# Altium schematic sheet dsPIC Click MCU v1.0.SchDoc
size B; SheetNumber: 1; SheetTotal: 2; PageSetup: Record=PageOptions|CenterHorizontal=True|CenterVertical=True|PrintScale=0.71|XCorrection=1.00|YCorrection=1.00|PrintKind=0|BorderSize=5000000|LeftOffset=0|BottomOffset=0|Orientation=2|PaperLength=1000|PaperWidth=1000|Scale=100|PaperSource=7|PrintQuality=-3|MediaType=1|DitherType=10|PrintScaleMode=1|PaperKind=Letter|PaperIndex=1
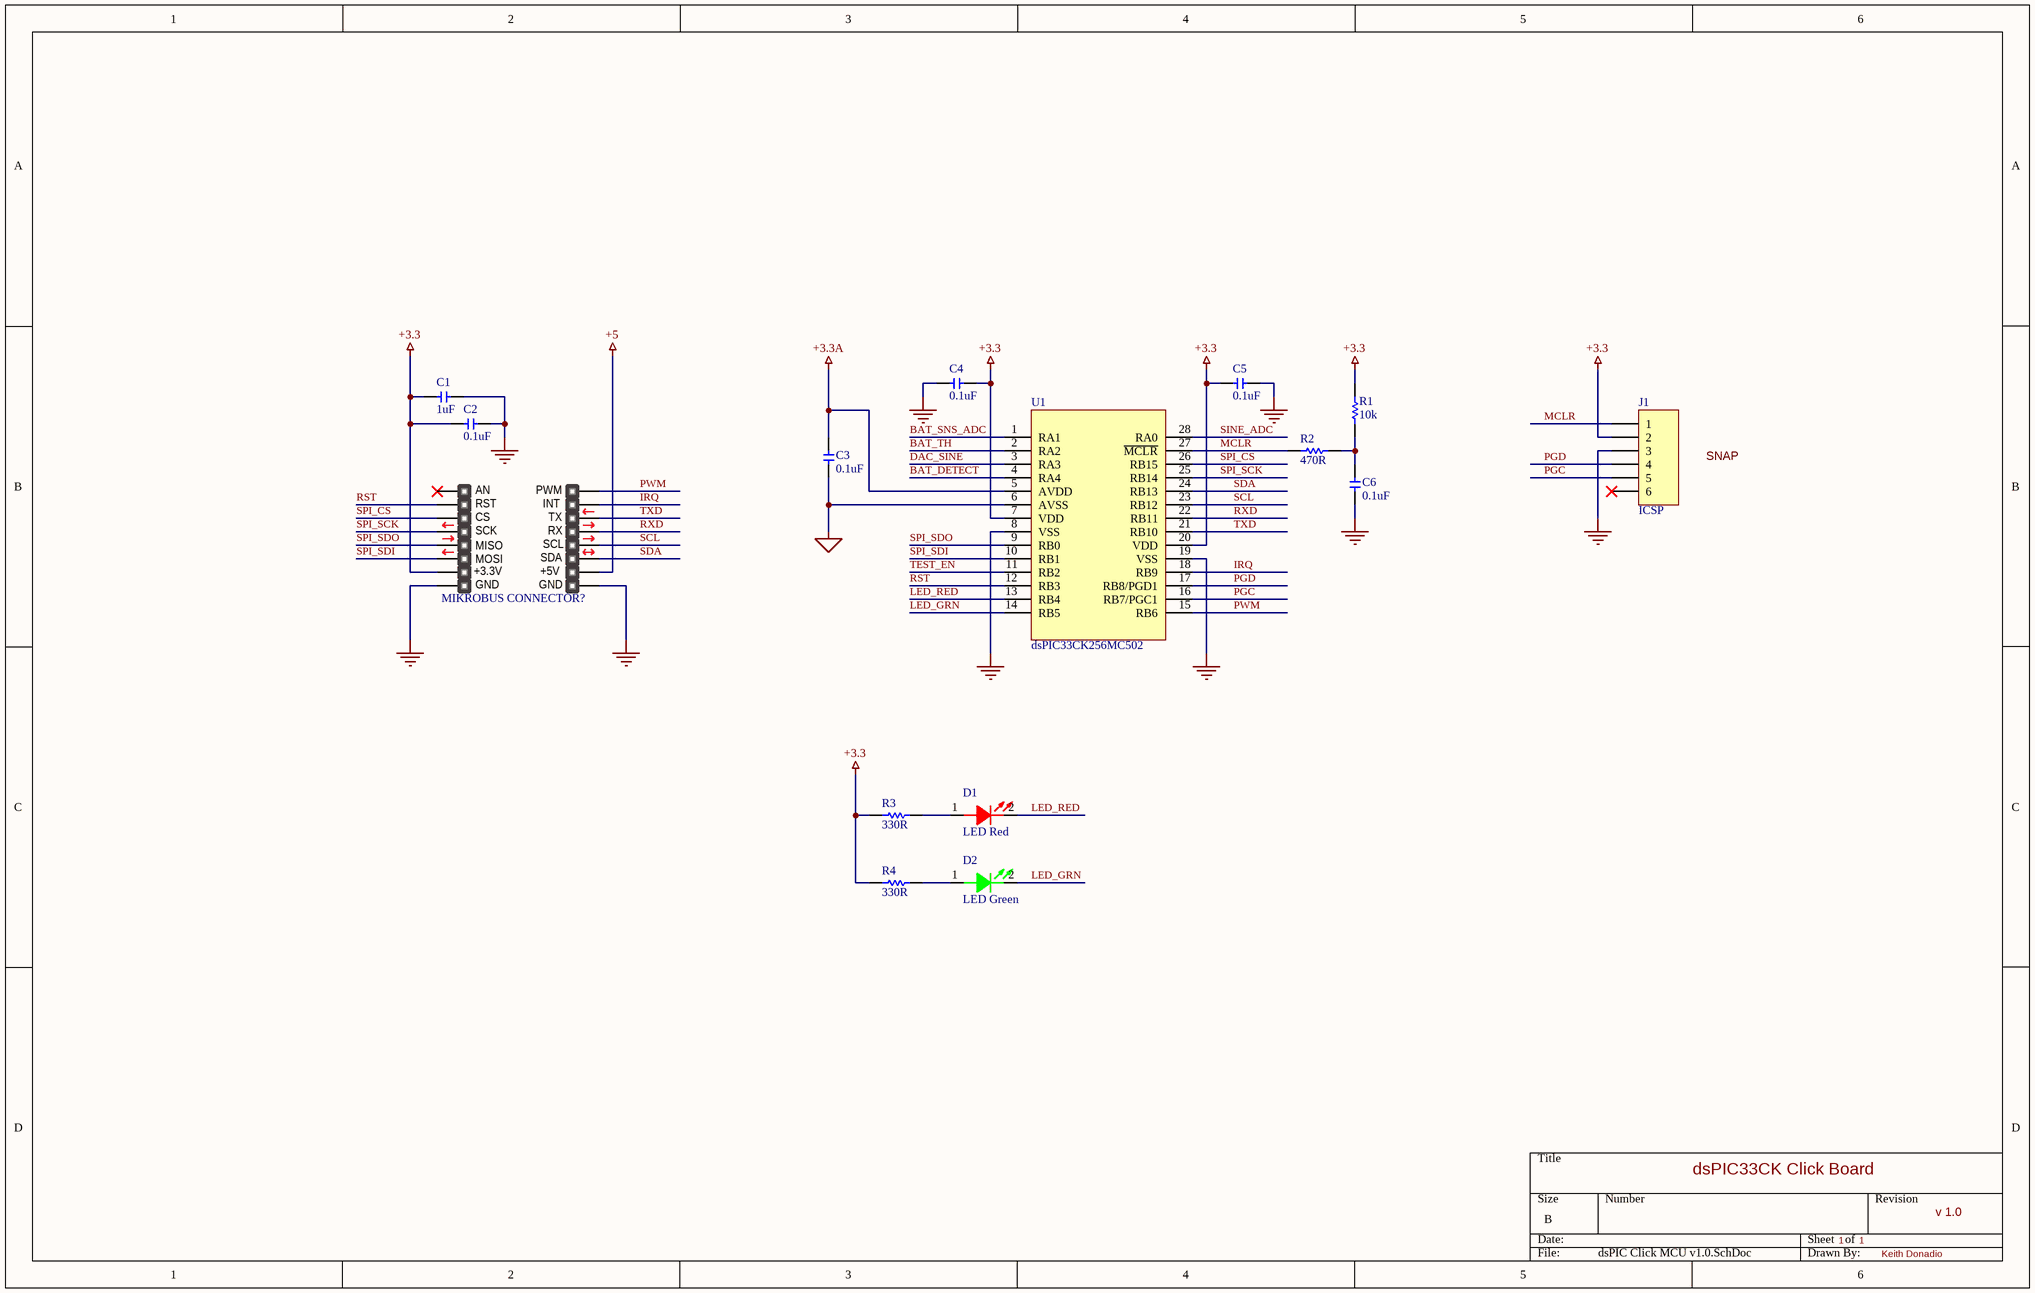
[diagram p0: dsPIC Click MCU v1.0.SchDoc]

## Parts
?  MikroBusLogo  [MB_Large]  (value not drawn)
C1  1uF  [0603]
C2  0.1uF  [0603]
C3  0.1uF  [0603]
C4  0.1uF  [0603]
C5  0.1uF  [0603]
C6  0.1uF  [0603]
D1  LED Red  [LTST-C190]
D2  LED Green  [LTST-C190]
J1  ICSP  [HDR1X6]
MIKROBUS_CONNECTOR?  MIKROBUS DEVICE CONN.  [MIKRO_BUS_WS2812]  (value not drawn)
R1  10k  [0603]
R2  470R  [0603]
R3  330R  [0603]
R4  330R  [0603]
U1  dsPIC33CK256MC502  [SSOP-28]

## Nets
+3.3: C1.2 C2.1 C4.2 C5.1 J1.2 MIKROBUS_CONNECTOR?.7(3.3V) R1.2 R3.2 R4.2 U1.7(VDD) U1.20(VDD)
+3.3A: C3.2 U1.5(AVDD)
+5: MIKROBUS_CONNECTOR?.10(5V)
AGND: C3.1 U1.6(AVSS)
GND: C1.1 C2.2 C4.1 C5.2 C6.2 J1.3 MIKROBUS_CONNECTOR?.8(GND) MIKROBUS_CONNECTOR?.9(GND) U1.8(VSS) U1.19(VSS)
BAT_DETECT: U1.4(RA4)
BAT_SNS_ADC: U1.1(RA1)
BAT_TH: U1.2(RA2)
DAC_SINE: U1.3(RA3)
IRQ: MIKROBUS_CONNECTOR?.15(INT) U1.18(RB9)
LED_GRN: D2.2(K) U1.14(RB5)
LED_RED: D1.2(K) U1.13(RB4)
MCLR: J1.1 R2.1 U1.27(~{MCLR})
PGC: J1.5 U1.16(RB7/PGC1)
PGD: J1.4 U1.17(RB8/PGD1)
PWM: MIKROBUS_CONNECTOR?.16(PWM) U1.15(RB6)
RST: MIKROBUS_CONNECTOR?.2(RST) U1.12(RB3)
RXD: MIKROBUS_CONNECTOR?.13(TX) U1.22(RB11)
SCL: MIKROBUS_CONNECTOR?.12(SCL) U1.23(RB12)
SDA: MIKROBUS_CONNECTOR?.11(SDA) U1.24(RB13)
SINE_ADC: U1.28(RA0)
SPI_CS: MIKROBUS_CONNECTOR?.3(CS) U1.26(RB15)
SPI_SCK: MIKROBUS_CONNECTOR?.4(SCK) U1.25(RB14)
SPI_SDI: MIKROBUS_CONNECTOR?.6(MOSI) U1.10(RB1)
SPI_SDO: MIKROBUS_CONNECTOR?.5(MISO) U1.9(RB0)
TEST_EN: U1.11(RB2)
TXD: MIKROBUS_CONNECTOR?.14(RX) U1.21(RB10)
NetC6_1: C6.1 R1.1 R2.2
NetD1_1: D1.1(A) R3.1
NetD2_1: D2.1(A) R4.1

Not connected (* = marked no-connect by the designer): J1 6*; MIKROBUS_CONNECTOR? 1(AN)*

## Notes on the sheet
- SNAP
- dsPIC33CK Click Board
- 1      1
- v 1.0
- Keith Donadio
- (in symbol MIKROBUS DEVICE CONN.) +3.3V; +5V

## Library data of the parts
? = MikroBusLogo: Logo; Published: 8-Jun-2000; LatestRevisionDate: 17-Jul-2002; LatestRevisionNote: Re-released for DXP Platform.; PackageReference: AXIAL-0.3; Publisher: Altium Limited; PackageDescription: Axial Device, Thru-Hole; 2 Leads; 0.3 in Pin Spacing
C1-C6 = Capacitor NP: Capacitor; Type: Ceramic; Revision: 0; ComponentLink1Description: Datasheet; Operating Temperature: -55C to +125C; Category: Capacitor; Quantity Override: 1
D1 = LED_RED: Red LED; Manufacturer 1: Lumex; Manufacturer Part Number 1: SML-LXT0805IW-TR; MCHP-ID: LED1020; Description_: DIO LED RED 2V 30mA 0805; Type: LED Single; Forward Current: 30mA; Power: 50mW; Reverse Current: 100uA; Reverse Voltage: 5V; Owner: Stephen Humberd; Populated: YES; Revision: A; Status: Design; Package: 0805; ComponentLink1URL: https://chn-vm-apps.microchip.com/mchprepo/parts/Datasheets/SML-LXT0805IW-TR.pdf; ComponentLink1Description: Datasheet; Operating Temperature: -25C to +80C; Category: Diode; Supplier 1: Digi-Key; Supplier Part Number 1: 67-1552-1-ND; Quantity Override: 1; Value: RED
D2 = LED_GRN: Green LED; Manufacturer 1: Lumex; Manufacturer Part Number 1: SML-LXT0805IW-TR; MCHP-ID: LED1020; Description_: DIO LED RED 2V 30mA 0805; Type: LED Single; Forward Current: 30mA; Power: 50mW; Reverse Current: 100uA; Reverse Voltage: 5V; Owner: Stephen Humberd; Populated: YES; Value: GRN; Revision: A; Status: Design; Package: 0805; ComponentLink1URL: https://chn-vm-apps.microchip.com/mchprepo/parts/Datasheets/SML-LXT0805IW-TR.pdf; ComponentLink1Description: Datasheet; Operating Temperature: -25C to +80C; Category: Diode; Supplier 1: Digi-Key; Supplier Part Number 1: 67-1552-1-ND; Quantity Override: 1
J1 = Header 6: Header, 6-Pin; LatestRevisionDate: 17-Jul-2002; LatestRevisionNote: Re-released for DXP Platform.; Publisher: Altium Limited
MIKROBUS_CONNECTOR? = MIKROBUS DEVICE CONN.: mikroBUS Target Header
R1-R4 = Res1: Resistor; Published: 8-Jun-2000; LatestRevisionDate: 17-Jul-2002; LatestRevisionNote: Re-released for DXP Platform.; PackageReference: AXIAL-0.3; Publisher: Altium Limited; PackageDescription: Axial Device, Thru-Hole; 2 Leads; 0.3 in Pin Spacing
U1 = dsPIC33CK256MC502: 16-bit MCU